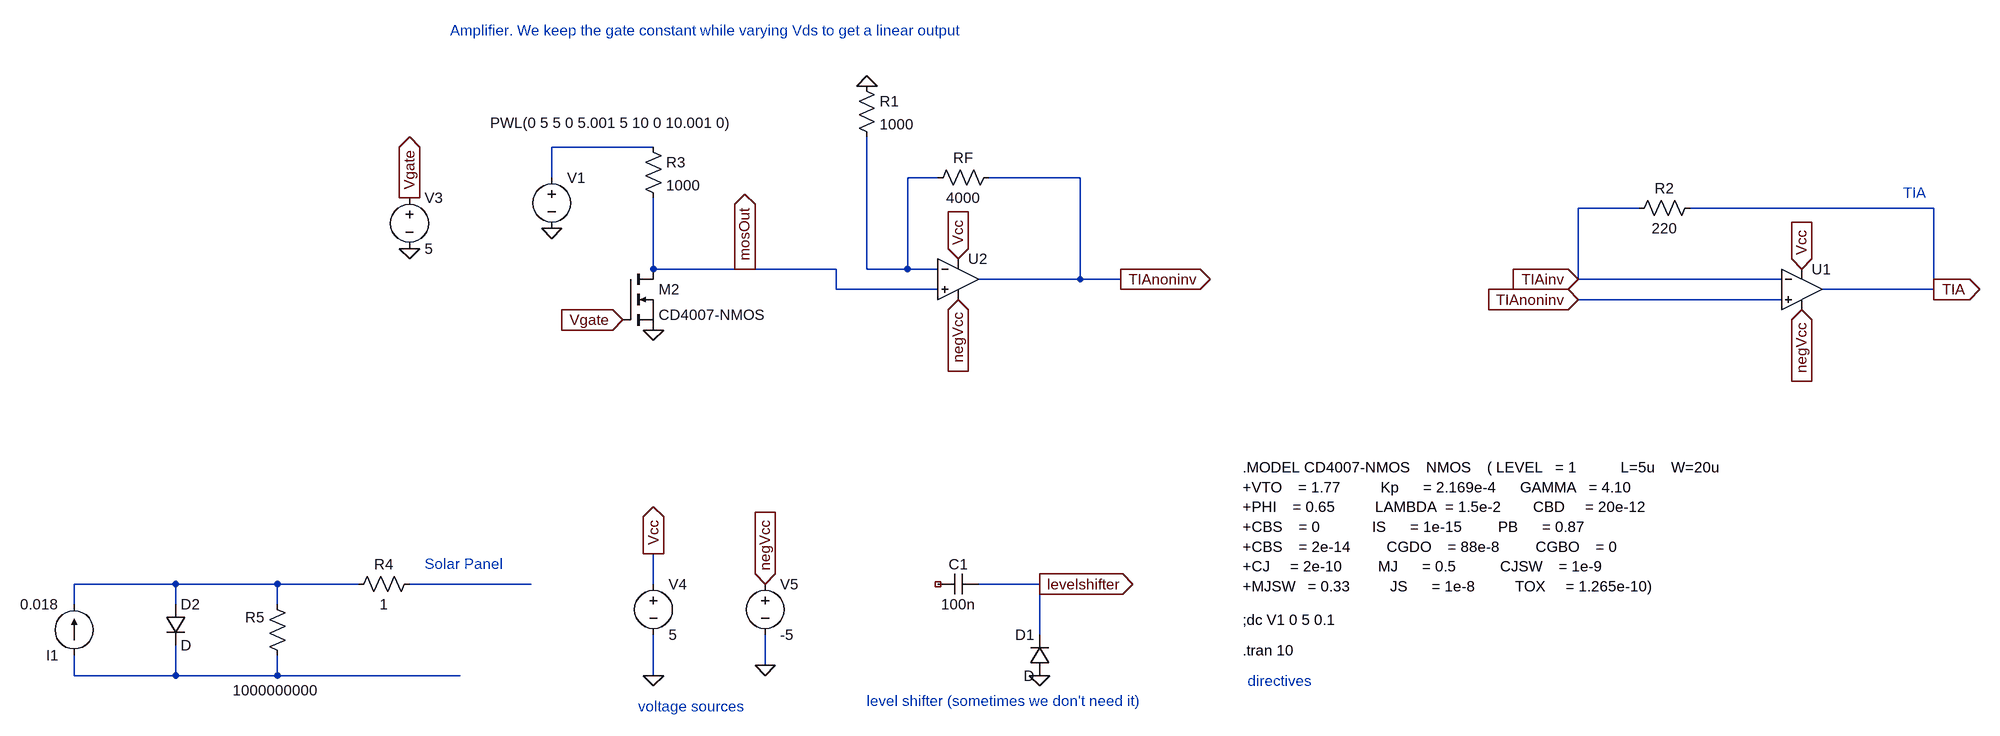
[diagram p0: schematic solar panel fet.asc]
solar panel fet.asc, the LTspice schematic file:
Version 4
SHEET 1 2468 880
WIRE -1280 -16 -1440 -16
WIRE -1440 32 -1440 -16
WIRE -832 32 -880 32
WIRE -608 32 -752 32
WIRE 272 80 176 80
WIRE 736 80 352 80
WIRE -1280 176 -1280 64
WIRE -1136 176 -1280 176
WIRE -992 176 -1136 176
WIRE -944 176 -944 -32
WIRE -880 176 -880 32
WIRE -880 176 -944 176
WIRE -832 176 -880 176
WIRE -608 192 -608 32
WIRE -608 192 -768 192
WIRE -544 192 -608 192
WIRE 176 192 176 80
WIRE 496 192 176 192
WIRE -992 208 -992 176
WIRE -832 208 -992 208
WIRE 736 208 736 80
WIRE 736 208 560 208
WIRE 496 224 176 224
WIRE -2032 672 -2192 672
WIRE -1872 672 -2032 672
WIRE -1744 672 -1872 672
WIRE -1472 672 -1664 672
WIRE -1280 672 -1280 624
WIRE -672 672 -768 672
WIRE -2192 704 -2192 672
WIRE -2032 704 -2032 672
WIRE -1872 704 -1872 672
WIRE -672 752 -672 672
WIRE -1104 800 -1104 752
WIRE -2192 816 -2192 784
WIRE -2032 816 -2032 768
WIRE -2032 816 -2192 816
WIRE -1872 816 -1872 784
WIRE -1872 816 -2032 816
WIRE -1584 816 -1872 816
WIRE -1280 816 -1280 752
FLAG -1280 272 0
FLAG -1328 256 Vgate
IOPIN -1328 256 In
FLAG -1664 144 0
FLAG -1664 64 Vgate
IOPIN -1664 64 Out
FLAG -800 160 Vcc
IOPIN -800 160 In
FLAG -800 224 negVcc
IOPIN -800 224 In
FLAG -1136 176 mosOut
IOPIN -1136 176 Out
FLAG -1440 112 0
FLAG -944 -112 0
FLAG -1280 624 Vcc
IOPIN -1280 624 Out
FLAG -1280 816 0
FLAG -1104 672 negVcc
IOPIN -1104 672 In
FLAG -1104 800 0
FLAG -672 816 0
FLAG -672 672 levelshifter
IOPIN -672 672 Out
FLAG 528 176 Vcc
IOPIN 528 176 In
FLAG 528 240 negVcc
IOPIN 528 240 In
FLAG 736 208 TIA
IOPIN 736 208 Out
FLAG 176 192 TIAinv
IOPIN 176 192 In
FLAG -544 192 TIAnoninv
IOPIN -544 192 Out
FLAG 176 224 TIAnoninv
IOPIN 176 224 In
SYMBOL res -736 16 R90
WINDOW 0 0 56 VBottom 2
WINDOW 3 32 56 VTop 2
SYMATTR InstName RF
SYMATTR Value 4000
SYMBOL res -1296 -32 R0
SYMATTR InstName R3
SYMATTR Value 1000
SYMBOL voltage -1440 16 R0
WINDOW 123 0 0 Left 0
WINDOW 39 0 0 Left 0
WINDOW 3 -97 -70 Left 2
SYMATTR Value PWL(0 5 5 0 5.001 5 10 0 10.001 0)
SYMATTR InstName V1
SYMBOL voltage -1664 48 R0
WINDOW 123 0 0 Left 0
WINDOW 39 0 0 Left 0
SYMATTR InstName V3
SYMATTR Value 5
SYMBOL nmos -1328 176 R0
SYMATTR InstName M2
SYMATTR Value CD4007-NMOS
SYMBOL OpAmps\\UniversalOpAmp -800 192 R0
SYMATTR InstName U2
SYMBOL res -960 -128 R0
SYMATTR InstName R1
SYMATTR Value 1000
SYMBOL voltage -1280 656 R0
WINDOW 123 0 0 Left 0
WINDOW 39 0 0 Left 0
SYMATTR InstName V4
SYMATTR Value 5
SYMBOL voltage -1104 656 R0
WINDOW 123 0 0 Left 0
WINDOW 39 0 0 Left 0
SYMATTR InstName V5
SYMATTR Value -5
SYMBOL cap -768 656 R90
WINDOW 0 0 32 VBottom 2
WINDOW 3 32 32 VTop 2
SYMATTR InstName C1
SYMATTR Value 100n
SYMBOL diode -656 816 R180
WINDOW 0 24 64 Left 2
WINDOW 3 24 0 Left 2
SYMATTR InstName D1
SYMBOL OpAmps\\UniversalOpAmp 528 208 R0
SYMATTR InstName U1
SYMBOL res 368 64 R90
WINDOW 0 0 56 VBottom 2
WINDOW 3 32 56 VTop 2
SYMATTR InstName R2
SYMATTR Value 220
SYMBOL current -2192 784 R180
WINDOW 123 0 0 Left 0
WINDOW 39 0 0 Left 0
SYMATTR InstName I1
SYMATTR Value 0.018
SYMBOL diode -2048 704 R0
SYMATTR InstName D2
SYMBOL res -1648 656 R90
WINDOW 0 0 56 VBottom 2
WINDOW 3 32 56 VTop 2
SYMATTR InstName R4
SYMATTR Value 1
SYMBOL res -1856 800 R180
WINDOW 0 36 76 Left 2
WINDOW 3 -49 -39 Left 2
SYMATTR InstName R5
SYMATTR Value 1000000000
TEXT -352 776 Left 2 !.tran 10
TEXT -352 488 Left 2 !.MODEL CD4007-NMOS    NMOS    ( LEVEL   = 1           L=5u    W=20u             \n+VTO    = 1.77          Kp      = 2.169e-4      GAMMA   = 4.10  \n+PHI    = 0.65          LAMBDA  = 1.5e-2        CBD     = 20e-12\n+CBS    = 0             IS      = 1e-15         PB      = 0.87\n+CBS    = 2e-14         CGDO    = 88e-8         CGBO    = 0\n+CJ     = 2e-10         MJ      = 0.5           CJSW    = 1e-9\n+MJSW   = 0.33          JS      = 1e-8          TOX     = 1.265e-10)
TEXT -352 728 Left 2 !;dc V1 0 5 0.1
TEXT -1640 640 Left 2 ;Solar Panel
TEXT 688 56 Left 2 ;TIA
TEXT -944 856 Left 2 ;level shifter (sometimes we don't need it)
TEXT -1304 864 Left 2 ;voltage sources
TEXT -344 824 Left 2 ;directives
TEXT -1600 -200 Left 2 ;Amplifier. We keep the gate constant while varying Vds to get a linear output

The netlist it stands for:
* solar panel fet.asc
RF TIAnoninv N002 4000
R3 N001 mosOut 1000
V1 N001 0 PWL(0 5 5 0 5.001 5 10 0 10.001 0)
V3 Vgate 0 5
M2 mosOut Vgate 0 0 CD4007-NMOS
XU2 mosOut N002 Vcc negVcc TIAnoninv level1 Avol=1Meg GBW=10Meg Vos=0 En=0 Enk=0 In=0 Ink=0 Rin=500Meg  ; pins In+ In- V+ V- OUT
R1 0 N002 1000
V4 Vcc 0 5
V5 negVcc 0 -5
C1 levelshifter NC_01 100n
D1 0 levelshifter D
XU1 TIAnoninv TIAinv Vcc negVcc TIA level1 Avol=1Meg GBW=10Meg Vos=0 En=0 Enk=0 In=0 Ink=0 Rin=500Meg  ; pins In+ In- V+ V- OUT
R2 TIA TIAinv 220
I1 N005 N003 0.018
D2 N003 N005 D
R4 N004 N003 1
R5 N005 N003 1000000000
.model D D
.lib standard.dio
.model NMOS NMOS
.model PMOS PMOS
.lib standard.mos
.tran 10
.MODEL CD4007-NMOS    NMOS    ( LEVEL   = 1           L=5u    W=20u
+VTO    = 1.77          Kp      = 2.169e-4      GAMMA   = 4.10
+PHI    = 0.65          LAMBDA  = 1.5e-2        CBD     = 20e-12
+CBS    = 0             IS      = 1e-15         PB      = 0.87
+CBS    = 2e-14         CGDO    = 88e-8         CGBO    = 0
+CJ     = 2e-10         MJ      = 0.5           CJSW    = 1e-9
+MJSW   = 0.33          JS      = 1e-8          TOX     = 1.265e-10)
;dc V1 0 5 0.1
* Solar Panel
* TIA
* level shifter (sometimes we don't need it)
* voltage sources
* directives
* Amplifier. We keep the gate constant while varying Vds to get a linear output
.lib UniversalOpAmp1.lib
.backanno
.end